# EAGLE schematic kitchen_timer (EAGLE 8.3.0)
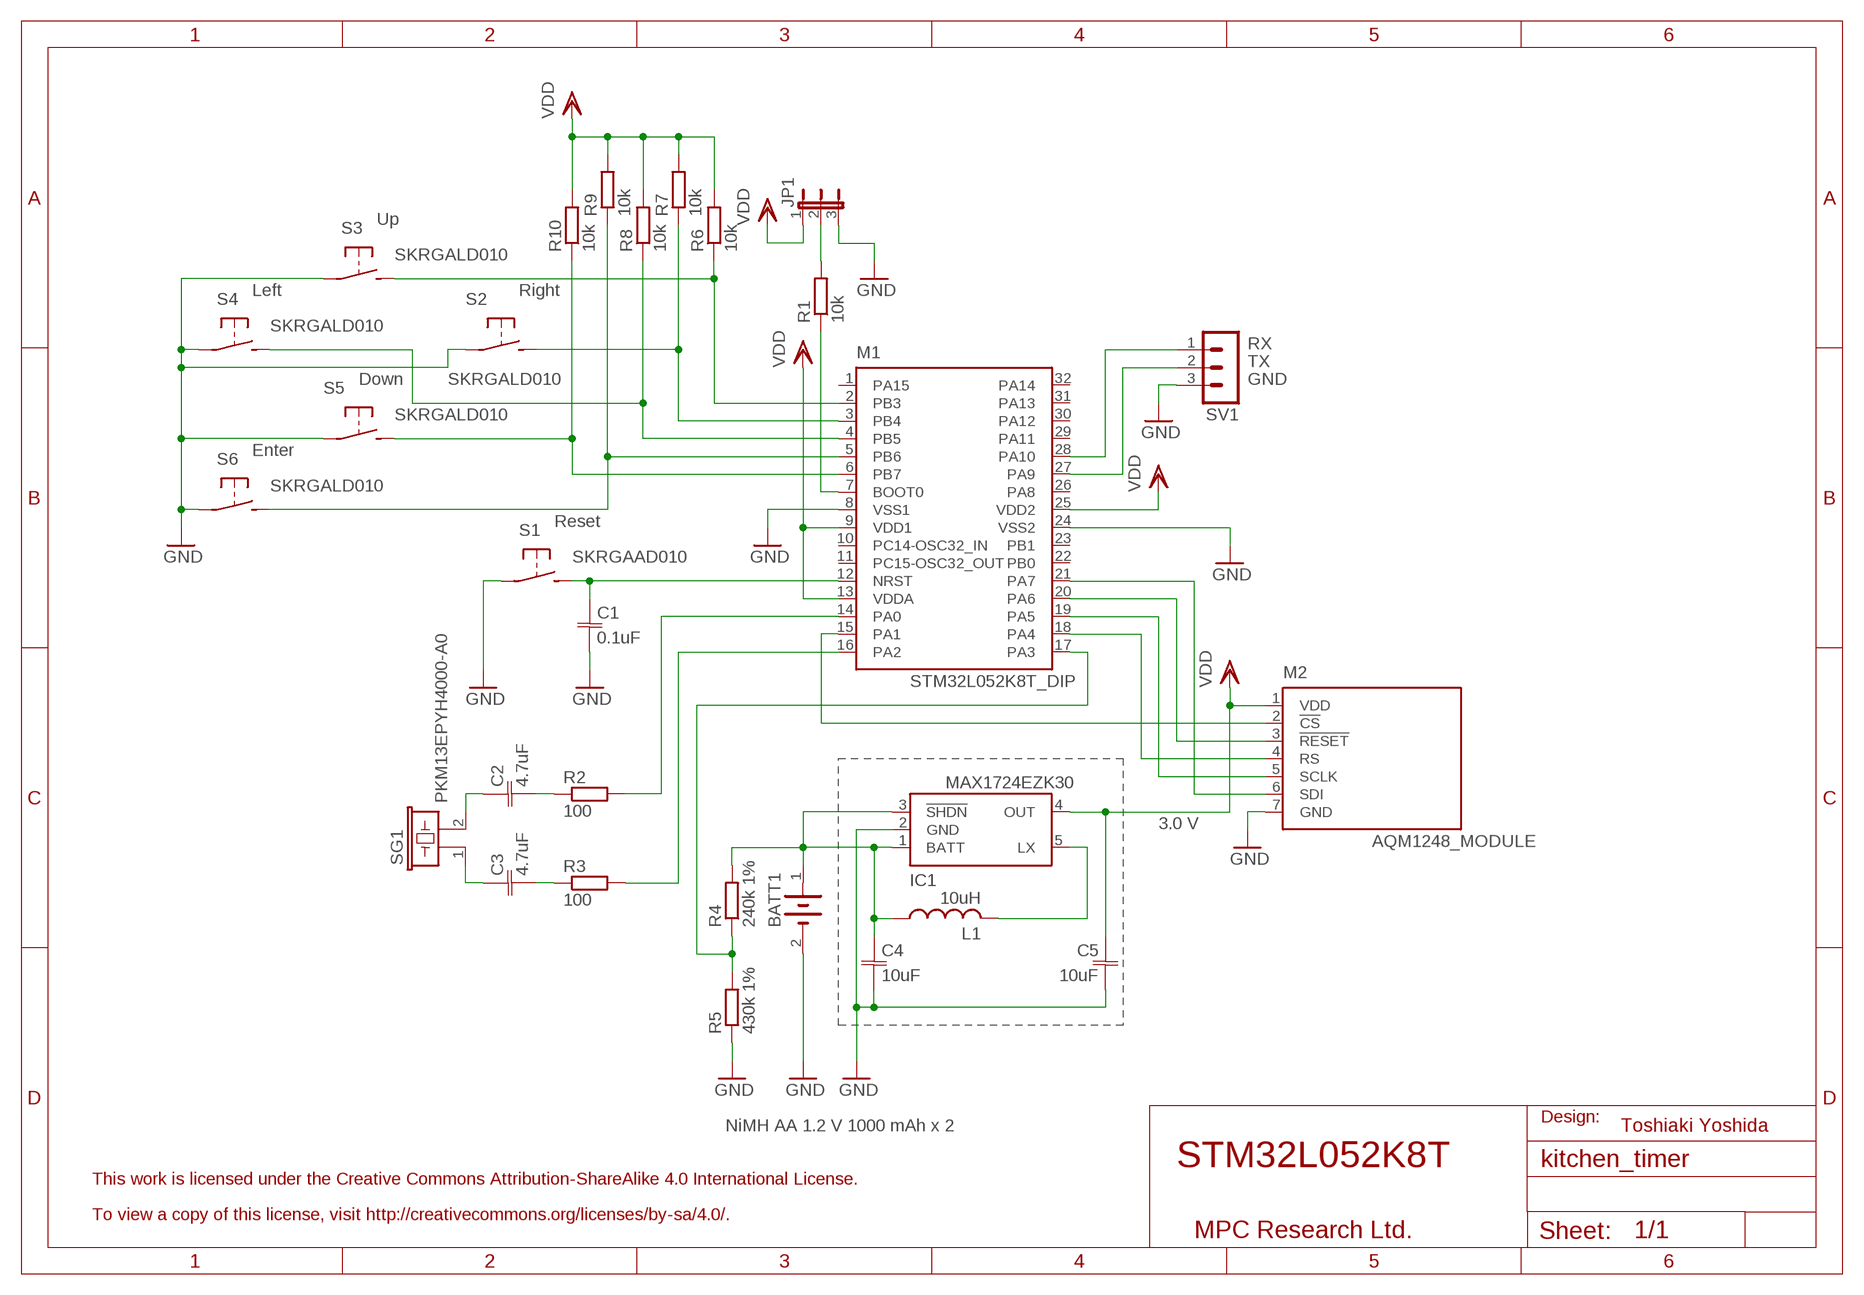
[diagram p0: schematic, sheet 1]

## Parts
BATT1  NiMH AA 1.2 V 1000 mAh x 2  BATTERY2  [TERMINAL]
C1  0.1uF  C-JIS050-024X044  [C050-024X044]
C2  4.7uF  C-JIS050-024X044  [C050-024X044]
C3  4.7uF  C-JIS050-024X044  [C050-024X044]
C4  10uF  C-JIS0603  [C0603]
C5  10uF  C-JIS0603  [C0603]
IC1  MAX1724EZK30  [SOT23-5L]
JP1  JP2E  [JP2]
L1  10uH  L-USL1812  [L1812]
M1  STM32L052K8T_DIP  [DIP32]
M2  AQM1248_MODULE  [AQM1248]
R1  10k  R-EU_0207/2V  [0207/2V]
R2  100  R-EU_0207/10  [0207/10]
R3  100  R-EU_0207/10  [0207/10]
R4  240k 1%  R-EU_0207/2V  [0207/2V]
R5  430k 1%  R-EU_0207/2V  [0207/2V]
R6  10k  R-EU_0207/7  [0207/7]
R7  10k  R-EU_0207/7  [0207/7]
R8  10k  R-EU_0207/7  [0207/7]
R9  10k  R-EU_0207/7  [0207/7]
R10  10k  R-EU_0207/7  [0207/7]
S1  SKRGAAD010  [SKRG]
S2  SKRGALD010  [SKRG]
S3  SKRGALD010  [SKRG]
S4  SKRGALD010  [SKRG]
S5  SKRGALD010  [SKRG]
S6  SKRGALD010  [SKRG]
SG1  PKM13EPYH4000-A0  EFBAA40D101  [EFBAA40D101]
SV1  MA03-1  [MA03-1]

## Nets
GND: BATT1.2(-) C1.2 C4.2 C5.2 IC1.2(GND) JP1.3 M1.8(VSS1) M1.24(VSS2) M2.7(GND) R5.1 S1.P$1 S2.P$1 S3.P$1 S4.P$1 S5.P$1 S6.P$1 SV1.3
N$1: M1.27(PA9) SV1.2
N$2: M1.7(BOOT0) R1.1
N$3: M1.28(PA10) SV1.1
N$4: C1.1 M1.12(NRST) S1.P$2
N$5: C3.2 R3.1
N$6: JP1.2 R1.2
N$7: C3.1 SG1.1
N$8: M1.14(PA0) R2.2
N$9: M1.16(PA2) R3.2
N$10: C2.2 R2.1
N$11: C2.1 SG1.2
N$12: M1.19(PA5) M2.5(SCLK)
N$13: M1.21(PA7) M2.6(SDI)
N$14: M1.18(PA4) M2.4(RS)
N$15: M1.15(PA1) M2.2(!CS)
N$16: M1.20(PA6) M2.3(!RESET)
N$17: M1.2(PB3) R6.1 S3.P$2
N$18: M1.3(PB4) R7.1 S2.P$2
N$19: M1.4(PB5) R8.1 S4.P$2
N$20: M1.6(PB7) R10.1 S5.P$2
N$21: M1.5(PB6) R9.1 S6.P$2
N$23: BATT1.1(+) C4.1 IC1.1(BATT) IC1.3(!SHDN) L1.1 R4.2
N$26: M1.17(PA3) R4.1 R5.2
N$29: IC1.5(LX) L1.2
VDD: C5.1 IC1.4(OUT) JP1.1 M1.9(VDD1) M1.13(VDDA) M1.25(VDD2) M2.1(VDD) R6.2 R7.2 R8.2 R9.2 R10.2
Unconnected: M1.1(PA15) M1.10(PC14-OSC32_IN) M1.11(PC15-OSC32_OUT) M1.22(PB0) M1.23(PB1) M1.26(PA8) M1.29(PA11) M1.30(PA12) M1.31(PA13) M1.32(PA14)

## Notes on the sheet
- Up
- Left | Right
- RX
- TX
- Down | GND
- Enter
- Reset
- 3.0 V
- Design:
- Toshiaki Yoshida
- STM32L052K8T
- This work is licensed under the Creative Commons Attribution-ShareAlike 4.0 International License.
- To view a copy of this license, visit http://creativecommons.org/licenses/by-sa/4.0/.
- MPC Research Ltd.

## Library data of the parts
BATT1 = misc:BATTERY2
C1-C5 = cap:C-JIS: CAPACITOR, Japanese symbol
IC1 = maxim:MAX1724: 1.5uA IQ, Step-Up DC-DC Converter in TSOT maxim integrated; OUTPUT: 3.0 V
JP1 = jumper:JP2E: JUMPER
L1 = resistor:L-US: INDUCTOR, American symbol
M1 = stm32:STM32L052K8T_DIP
M2 = akizuki:AQM1248_MODULE
R1-R10 = resistor:R-EU_: RESISTOR, European symbol
S1 = switch-alps:SKRG: SKRG ALPS Rdial Type TACT Switch; COLOR: Black; HEIGHT: 4.3mm
S2-S6 = switch-alps:SKRG: SKRG ALPS Rdial Type TACT Switch; COLOR: Black; HEIGHT: 7mm
SG1 = buzzer:EFB?: Piezoelectric Acoustic Transducer Source: Panbasonic .. 2SC1685.pdf; OC_FARNELL: unknown; OC_NEWARK: unknown
SV1 = con-lstb:MA03-1: PIN HEADER; OC_FARNELL: unknown; OC_NEWARK: unknown